# EAGLE design power-control (EAGLE 6.4)
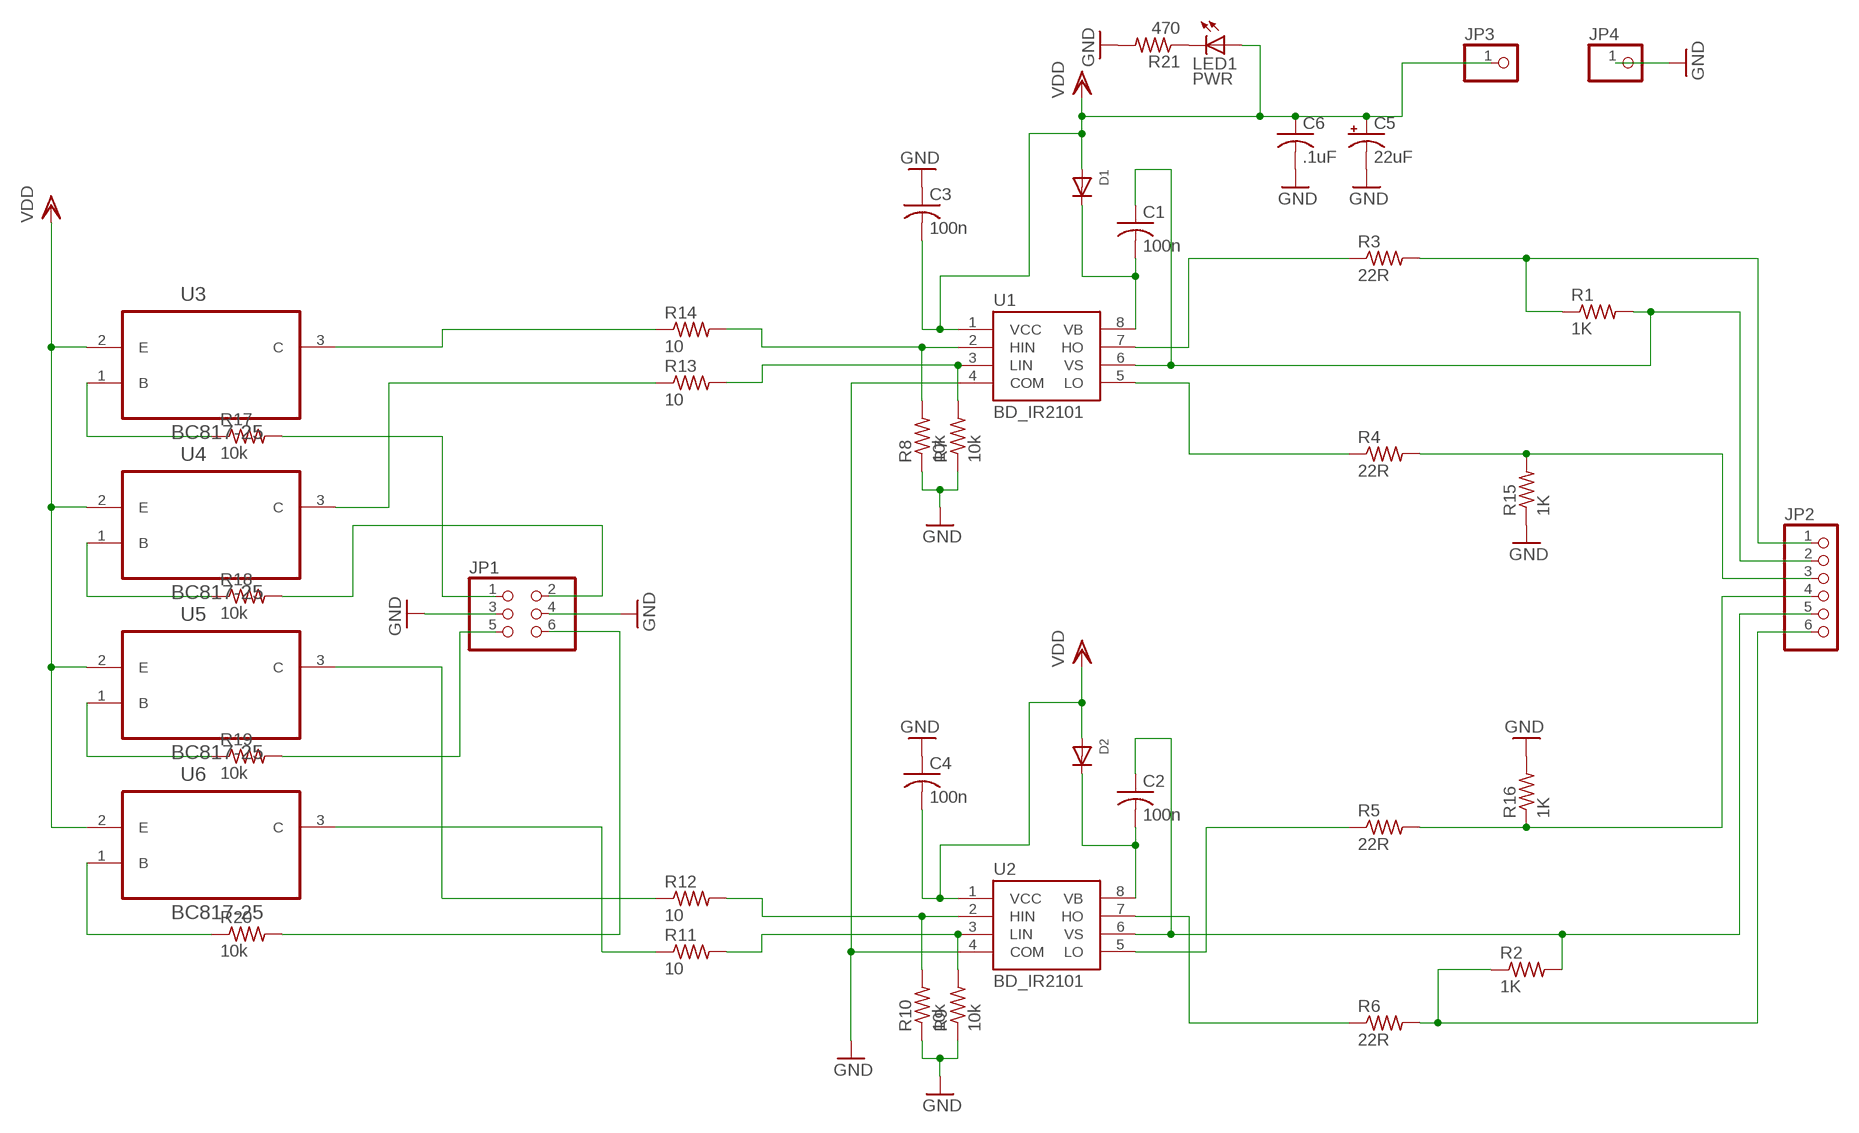
[diagram p0: schematic, sheet 1]

## Parts
C1  100n  C-USC0402  [C0402]
C2  100n  C-USC0402  [C0402]
C3  100n  C-USC0402  [C0402]
C4  100n  C-USC0402  [C0402]
C5  22uF  CPOL-USB/3528-21W  [B/3528-21W]
C6  .1uF  C-USC0805  [C0805]
D1  DIODESOD-523  [SOD-523]
D2  DIODESOD-523  [SOD-523]
JP1  PINHD-2X3  [2X03]
JP2  PINHD-1X6  [1X06]
JP3  PINHD-1X1  [1X01]
JP4  PINHD-1X1  [1X01]
LED1  PWR  LEDCHIP-LED0805  [CHIP-LED0805]
R1  1K  R-US_R0201  [R0201]
R2  1K  R-US_R0201  [R0201]
R3  22R  R-US_R0201  [R0201]
R4  22R  R-US_R0201  [R0201]
R5  22R  R-US_R0201  [R0201]
R6  22R  R-US_R0201  [R0201]
R7  10k  R-US_R0201  [R0201]
R8  10k  R-US_R0201  [R0201]
R9  10k  R-US_R0201  [R0201]
R10  10k  R-US_R0201  [R0201]
R11  10  R-US_R0201  [R0201]
R12  10  R-US_R0201  [R0201]
R13  10  R-US_R0201  [R0201]
R14  10  R-US_R0201  [R0201]
R15  1K  R-US_R0201  [R0201]
R16  1K  R-US_R0201  [R0201]
R17  10k  R-US_R0201  [R0201]
R18  10k  R-US_R0201  [R0201]
R19  10k  R-US_R0201  [R0201]
R20  10k  R-US_R0201  [R0201]
R21  470  R-US_R0201  [R0201]
U1  BD_IR2101  [SO8]
U2  BD_IR2101  [SO8]
U3  BC817-25  [SOT95P240X97-3N]
U4  BC817-25  [SOT95P240X97-3N]
U5  BC817-25  [SOT95P240X97-3N]
U6  BC817-25  [SOT95P240X97-3N]

## Nets
GND: C3.1 C4.1 C5.- C6.2 JP1.3 JP1.4 JP4.1 R7.1 R8.1 R9.1 R10.1 R15.1 R16.2 R21.2 U1.4(COM) U2.4(COM)
HO_1: R3.1 U1.7(HO)
HO_2: R6.1 U2.7(HO)
LO_1: R4.1 U1.5(LO)
LO_2: R5.1 U2.5(LO)
MOTOR_OUT_1: C1.1 JP2.2 R1.2 U1.6(VS)
MOTOR_OUT_2: C2.1 JP2.5 R2.2 U2.6(VS)
N$1: R13.1 U4.3(C)
N$2: R11.1 U6.3(C)
N$3: R8.2 R14.2 U1.2(HIN)
N$4: R7.2 R13.2 U1.3(LIN)
N$5: R10.2 R12.2 U2.2(HIN)
N$6: R9.2 R11.2 U2.3(LIN)
N$7: C1.2 D1.K(C) U1.8(VB)
N$8: C2.2 D2.K(C) U2.8(VB)
N$9: R12.1 U5.3(C)
N$10: JP2.4 R5.2 R16.1
N$11: R14.1 U3.3(C)
N$12: JP1.1 R17.2
N$13: JP1.5 R19.2
N$14: JP1.2 R18.2
N$15: JP2.1 R1.1 R3.2
N$16: JP1.6 R20.2
N$17: R17.1 U3.1(B)
N$18: R18.1 U4.1(B)
N$19: R19.1 U5.1(B)
N$20: JP2.3 R4.2 R15.2
N$21: R20.1 U6.1(B)
N$22: LED1.C R21.1
N$25: JP2.6 R2.1 R6.2
VDD: C3.2 C4.2 C5.+ C6.1 D1.A D2.A JP3.1 LED1.A U1.1(VCC) U2.1(VCC) U3.2(E) U4.2(E) U5.2(E) U6.2(E)

## Library data of the parts
C1-C4 C6 = rcl:C-US: CAPACITOR, American symbol
C5 = rcl:CPOL-US: POLARIZED CAPACITOR, American symbol
D1 D2 = adafruit:DIODE: Diode SMADIODE - SMA Surface Mount Package 20V 1A Schottky Diode Digikey: 641-1014-6-ND DO-1N4148 - Through Hole Small Current Diode SOD-123 20V 1 A (.5mV Vf) Schottky Diode - Digikey: MBRX120TPMSCT-ND SOD-323 10V 570mA (.38mV Vf, 3ns) Schottky Diode - Digikey: ZLLS410CT-ND SOD-523 30V 30mA Schottky Diode (RB751S-40TE61) - Digikey: RB751S-40TE61CT-ND SOT23-R/W - SOT23 Package (R = Solder Paste/Reflow Ovens, W = Hand-Soldering) BAT54Film 40V 300mA - Digikey: 497-7162-1-ND
JP1 = pinhead:PINHD-2X3: PIN HEADER
JP2 = pinhead:PINHD-1X6: PIN HEADER
JP3 JP4 = pinhead:PINHD-1X1: PIN HEADER
LED1 = adafruit:LED: LED OSRAM: - CHIPLED LG R971, LG N971, LY N971, LG Q971, LY Q971, LO R971, LY R971 LH N974, LH R974 LS Q976, LO Q976, LY Q976 LO Q996 - Hyper CHIPLED LW Q18S LB Q993, LB Q99A, LB R99A - SideLED LS A670, LO A670, LY A670, LG A670, LP A670 LB A673, LV A673, LT A673, LW A673 LH A674 LY A675 LS A676, LA A676, LO A676, LY A676, LW A676 LS A679, LY A679, LG A679 - Hyper Micro SIDELED® LS Y876, LA Y876, LO Y876, LY Y876 LT Y87S - SmartLED LW L88C, LW L88S LB L89C, LB L89S, LG L890 LS L89K, LO L89K, LY L89K LS L896, LA L896, LO L896, LY L896 - TOPLED LS T670, LO T670, LY T670, LG T670, LP T670 LSG T670, LSP T670, LSY T670, LOP T670, LYG T670 LG T671, LOG T671, LSG T671 LB T673, LV T673, LT T673, LW T673 LH T674 LS T676, LA T676, LO T676, LY T676, LB T676, LH T676, LSB T676, LW T676 LB T67C, LV T67C, LT T67C, LS T67K, LO T67K, LY T67K, LW E67C LS E67B, LA E67B, LO E67B, LY E67B, LB E67C, LV E67C, LT E67C LW T67C LS T679, LY T679, LG T679 LS T770, LO T770, LY T770, LG T770, LP T770 LB T773, LV T773, LT T773, LW T773 LH T774 LS E675, LA E675, LY E675, LS T675 LS T776, LA T776, LO T776, LY T776, LB T776 LHGB T686 LT T68C, LB T68C - Hyper Mini TOPLED® LB M676 - Mini TOPLED Santana® LG M470 LS M47K, LO M47K, LY M47K Source: http://www.osram.convergy.de/
R1-R21 = rcl:R-US_: RESISTOR, American symbol
U1 U2 = open-bldc:BD
U3-U6 = Fairchild_By_element14_Batch_1:BC817-25: NPN Epitaxial Silicon Transistor; MPN: BC817-25; OC_FARNELL: 1228216; OC_NEWARK: -; PACKAGE: SOT-3; SUPPLIER: Fairchild

## Board
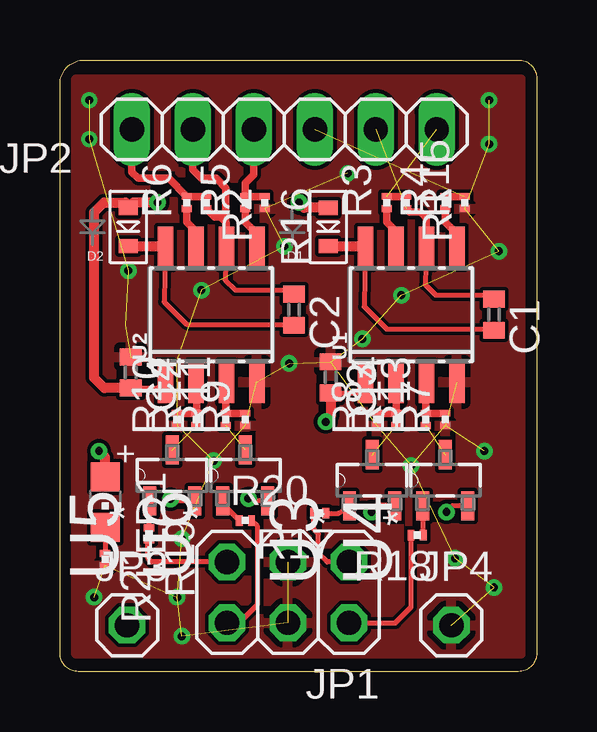
[diagram p1: board, top side]
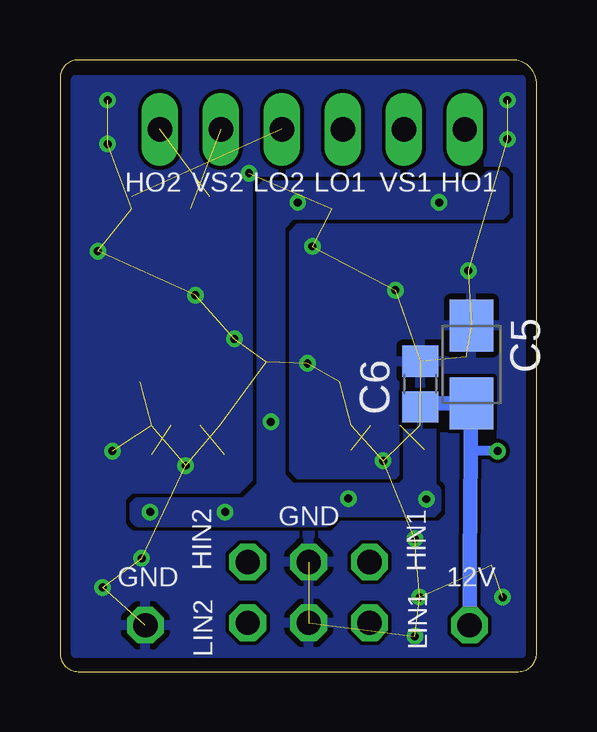
[diagram p2: board, bottom side, seen from below]

Size 19.86 x 25.5 mm. Coordinates in mm from the lower left corner, seen from the top.
Outline: 1.02,25.5 19.1,25.5 arc-90 19.86,24.74 19.86,0.76 arc-90 19.1,0 0.76,0 arc-90 0,0.76 0,24.49 arc-90 1.02,25.5
Copper layers (1*16): Top 0.0356mm / dielectric 1.5011mm / Bottom 0.0356mm
Design rules "LaenPCBOrder *": minimum track width 6mil, minimum drill 13mil, track to track 6mil, track to pad 6mil, pad to pad 6mil, via to via 6mil, smd to smd 6mil, copper to edge 15mil, drill to drill 6mil, minimum pad ring 7mil, minimum via ring 7mil, stop-mask expansion 4mil, vias tented up to drill 14mil, thermal gap 10mil

### Footprints (pad centres in the part's own frame; a part is rotated, then mirrored left to right if it is on the bottom)
C0402 = smd 0.7 x 0.9: 1 -0.65,0; 2 0.65,0
B/3528-21W = smd 2.15 x 1.8: + 1.625,0; - -1.625,0
C0805 = smd 1.3 x 1.5: 1 -0.95,0; 2 0.95,0
SOD-523 = smd 0.8 x 0.6: A 0,-0.8; K 0,0.8
2X03 = drill 1.016 octagon: 1 -2.54,-1.27; 2 -2.54,1.27; 3 0,-1.27; 4 0,1.27; 5 2.54,-1.27; 6 2.54,1.27
1X06 = drill 1.016 long: 1 -6.35,0; 2 -3.81,0; 3 -1.27,0; 4 1.27,0; 5 3.81,0; 6 6.35,0
1X01 = drill 1.016 octagon: 1 0,0
CHIP-LED0805 = smd 1.2 x 1.2: A 0,-1.05; C 0,1.05
R0201 = smd 0.28 x 0.43: 1 -0.255,0; 2 0.255,0
SO8 = smd 0.65 x 1.75: 1 -1.905,-2.8; 2 -0.635,-2.8; 3 0.635,-2.8; 4 1.905,-2.8; 5 1.905,2.8; 6 0.635,2.8; 7 -0.635,2.8; 8 -1.905,2.8
SOT95P240X97-3N = smd 1.219 x 0.533: 1 -1.067,0.94; 2 -1.067,-0.94; 3 1.067,0

### Placement (x,y rotation side)
C1  18.08,14.88 270 top
C2  9.75,15.09 270 top
C3  11.28,12.27 270 top
C4  2.95,12.47 270 top
C5  2.72,12.8 270 bottom
C6  4.85,11.99 90 bottom
D1  11.18,18.54 180 top
D2  2.84,18.54 180 top
JP1  9.5,3.3 180 top
JP2  9.35,22.61 180 top
JP3  2.79,1.93 0 top
JP4  16.31,1.93 0 top
LED1  1.88,7.06 180 top
R1  14.43,19.56 270 top
R2  6.1,19.56 270 top
R3  13.61,19.56 90 top
R4  16.05,19.56 90 top
R5  7.72,19.56 90 top
R6  5.28,19.56 90 top
R7  16.05,10.52 90 top
R8  13.21,10.52 90 top
R9  7.72,10.52 90 top
R10  4.88,10.52 90 top
R11  6.91,10.52 90 top
R12  5.69,10.52 90 top
R13  15.24,10.52 90 top
R14  14.02,10.52 90 top
R15  16.87,19.56 90 top
R16  8.53,19.56 270 top
R17  10.82,6.6 180 top
R18  14.88,5.69 180 top
R19  3.71,5.74 270 top
R20  7.72,6.3 0 top
R21  1.88,4.67 270 top
U1  14.63,14.88 0 top
U2  6.3,14.88 0 top
U3  13,7.98 90 top
U4  16.05,7.98 90 top
U5  4.67,8.18 90 top
U6  7.72,8.18 90 top

### Tracks (layer width: path | path; a pad name or v marks a point on that pad's centre or on a via)
GND  (via drill 0.33)  (36 unrouted)
  other vias: 5.89,15.9 14.22,15.7 9.55,12.85 11.99,20.78 2.84,16.71 12.6,13.87 17.88,23.83 17.88,22 18.29,17.53 17.68,9.19 18.08,3.51 16.46,4.72 1.42,3.1 5.08,1.47 4.88,3.1 1.22,23.83 1.22,22.2 9.35,17.73 5.08,5.54 6.4,8.79 14.63,8.59
  pour Bottom (rank 6): 0.66,24.69 0.66,0.76 19.2,0.76 19.2,24.69
  pour Top (rank 6): 0.66,24.69 0.66,0.76 19.2,0.76 19.2,24.69
HO_1
  Top 0.305: U1.7 14,18.36 13.61,18.74 R3.1
HO_2
  Top 0.305: U2.7 5.66,18.36 5.28,18.74 R6.1
LO_1
  Top 0.305: U1.5 16.54,18.26 16.05,18.74 R4.1
LO_2
  Top 0.305: U2.5 8.2,18.26 7.72,18.74 R5.1
MOTOR_OUT_1  (1 unrouted)
  Top 0.203: U1.6 15.21,16.13 15.65,15.7 17.87,15.7 C1.1
  Top 0.305: U1.6 15.27,18.92 15.04,19.15 14.58,19.15 R1.2
MOTOR_OUT_2
  Top 0.203: U2.6 6.88,16.33 7.32,15.9 9.54,15.9 C2.1
  Top 0.305: R2.2 6.45,18.95 6.71,18.95 6.93,18.72 U2.6 6.91,17.71 6.91,20.17 6.5,20.57 5.89,20.57 5.54,20.93 JP2.5
N$1  (1 unrouted)
N$2  (1 unrouted)
N$3
  Top 0.305: U1.2 14.02,12.06 R14.2 R8.2
N$4
  Top 0.305: U1.3 15.24,12.06 R13.2 R7.2
N$5
  Top 0.305: U2.2 5.69,12.06 R12.2 R10.2
N$6
  Top 0.305: U2.3 6.91,12.06 R11.2 R9.2
N$7
  Top 0.203: U1.8 12.67,15.21 13.61,14.27 17.97,14.27 C1.2
  Top 0.406: D1.K 12.67,17.74 U1.8
N$8
  Top 0.203: U2.8 4.34,15.42 5.28,14.48 9.64,14.48 C2.2
  Top 0.406: D2.K 4.34,17.74 U2.8
N$9  (1 unrouted)
N$10
  Top 0.305: R16.1 R5.2 7.72,20.37 8.08,20.73 JP2.4
N$11  (1 unrouted)
N$12
  Top 0.203: JP1.1 11.13,4.57 10.77,4.93 10.77,5.74 10.57,5.94 R17.2
N$13
  Top 0.203: JP1.5 3.81,4.57 3.66,4.72 3.66,5.43 R19.2
N$14
  Top 0.203: JP1.2 13.97,2.03 14.63,2.69 R18.2
N$15  (1 unrouted)
  Top 0.305: R3.2 R1.1
N$16
  Top 0.203: JP1.6 7.47,2.03 8.23,2.79 8.23,6.05 R20.2
N$17
  Top 0.203: R17.1 11.61,6.6 U3.1
N$18
  Top 0.203: R18.1 15.14,6.88 U4.1
N$19
  Top 0.203: 3.66,7.09 U5.1 R19.1
N$20  (1 unrouted)
  Top 0.305: R4.2 R15.2
N$21
  Top 0.203: U6.1 6.86,7.11 6.86,6.91 R20.1
N$22
  Top 0.203: LED1.C R21.1
N$25
  Top 0.305: R2.1 R6.2 4.52,20.57 3.25,20.57 3,20.83 JP2.6
VDD  (via drill 0.33)
  Top 0.203: U6.2 7.95,7.11 v7.85,7.21 | U5.2 4.67,7.11 v4.6,7.19 | C3.2 12.36,11.62 U1.1 | C4.2 4.03,11.82 U2.1 | U4.2 16.36,6.91 v16.1,6.65 | U3.2 13.28,6.96 v12.98,6.65
  Top 0.406: C4.2 1.84,11.82 1.42,12.24 1.42,19.15 1.83,19.56 2.73,19.56 2.73,19.46 D2.A 3.06,19.56 v4.06,19.56 | C3.2 11.28,10.62 v11.07,10.41 | LED1.A 1.88,8.94 v1.63,9.2 | D1.A 10.17,19.34 v9.96,19.56
  Bottom 0.406: v1.63,9.2 2.74,9.2
  Bottom 0.61: JP3.1 2.79,4.6 2.74,9.2 C5.+ 4.71,11.18 C6.1
  pour Bottom: 1.42,20.78 2.03,20.78 2.44,20.37 11.38,20.37 11.58,20.17 11.58,7.77 12.19,7.16 16.66,7.16 16.87,6.96 16.87,6.35 16.66,6.15 8.74,6.15 8.33,6.55 4.27,6.55 4.06,6.76 4.06,7.57 4.27,7.77 4.27,11.02 4.47,11.23 5.49,11.23 5.49,7.98 5.69,7.77 10.16,7.77 10.57,8.18 10.57,18.54 10.16,18.95 1.42,18.95 1.22,19.15 1.22,20.57

### Text on the board
bPlace: HO1 | VS1 | LO1 | LO2 | VS2 | HO2 | GND | HIN1 | HIN2 | 12V | GND | LIN1 | LIN2